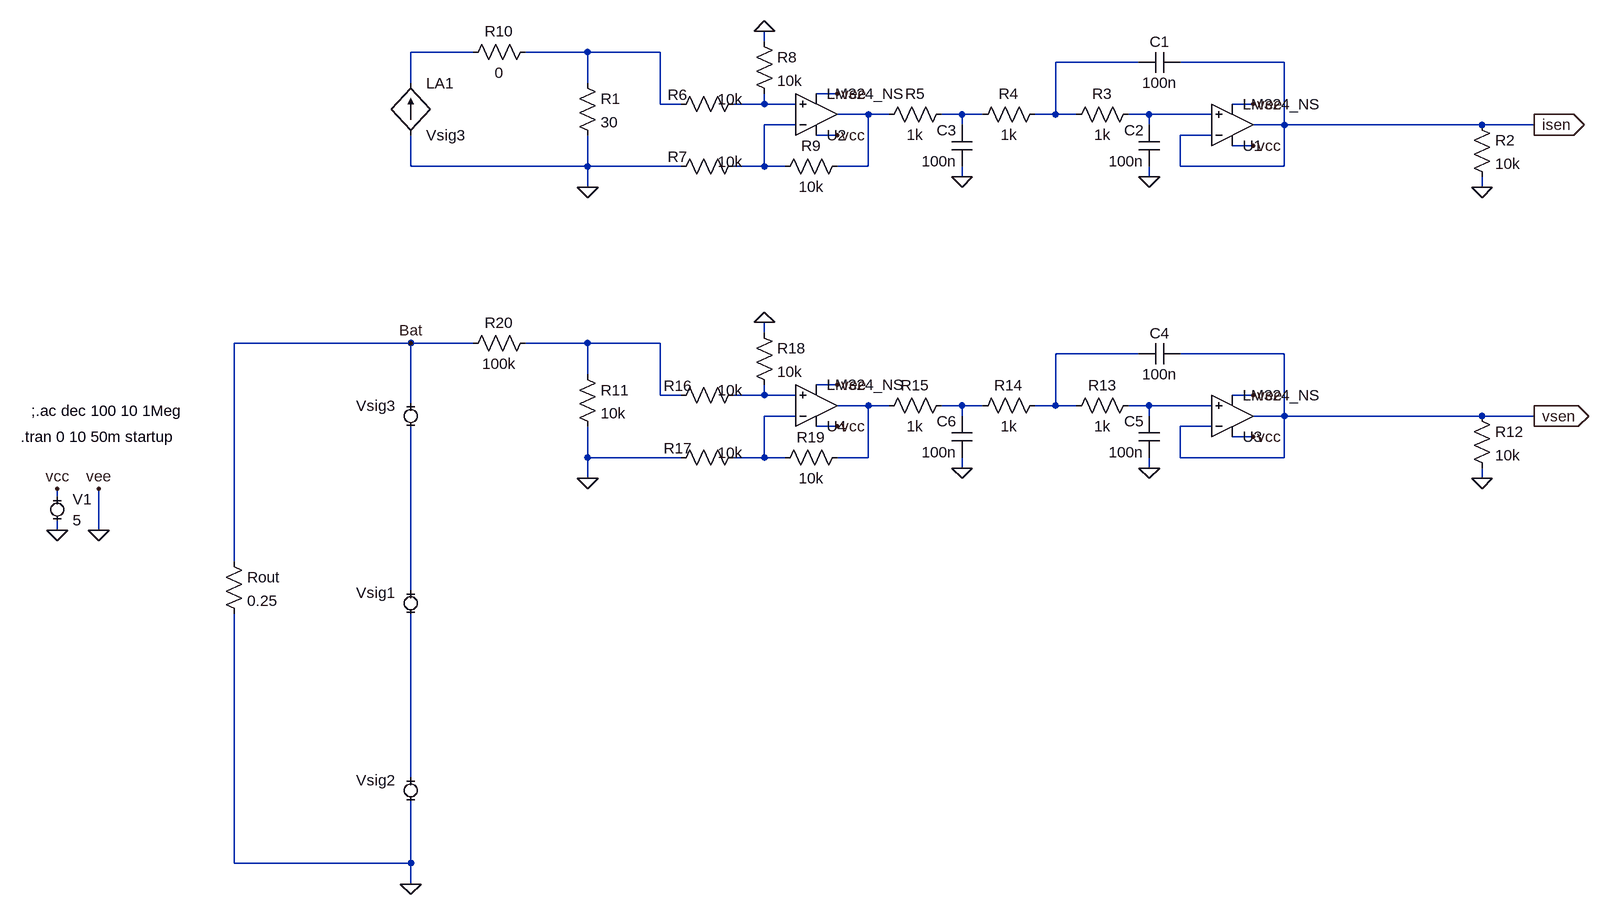
[diagram p0: schematic sensors.asc]
sensors.asc, the LTspice schematic file:
Version 4
SHEET 1 1304 1268
WIRE 16 -80 16 -96
WIRE -432 -64 -528 -64
WIRE -256 -64 -352 -64
WIRE -144 -64 -256 -64
WIRE 592 -48 464 -48
WIRE 816 -48 656 -48
WIRE -528 -16 -528 -64
WIRE -256 -16 -256 -64
WIRE 128 0 96 0
WIRE -144 16 -144 -64
WIRE -112 16 -144 16
WIRE 16 16 16 0
WIRE 16 16 -32 16
WIRE 64 16 16 16
WIRE 768 16 736 16
WIRE 176 32 128 32
WIRE 208 32 176 32
WIRE 320 32 288 32
WIRE 352 32 320 32
WIRE 464 32 464 -48
WIRE 464 32 432 32
WIRE 496 32 464 32
WIRE 608 32 576 32
WIRE 704 32 608 32
WIRE 64 48 16 48
WIRE 320 48 320 32
WIRE 608 48 608 32
WIRE 816 48 816 -48
WIRE 816 48 768 48
WIRE 1120 48 816 48
WIRE 1200 48 1120 48
WIRE 128 64 96 64
WIRE 704 64 656 64
WIRE 768 80 736 80
WIRE -528 112 -528 64
WIRE -256 112 -256 64
WIRE -256 112 -528 112
WIRE -112 112 -256 112
WIRE 16 112 16 48
WIRE 16 112 -32 112
WIRE 48 112 16 112
WIRE 176 112 176 32
WIRE 176 112 128 112
WIRE 656 112 656 64
WIRE 816 112 816 48
WIRE 816 112 656 112
WIRE 320 128 320 112
WIRE 608 128 608 112
WIRE -256 144 -256 112
WIRE 1120 144 1120 128
WIRE 16 368 16 352
WIRE -528 384 -800 384
WIRE -432 384 -528 384
WIRE -256 384 -352 384
WIRE -144 384 -256 384
WIRE 592 400 464 400
WIRE 816 400 656 400
WIRE -256 432 -256 384
WIRE 128 448 96 448
WIRE -144 464 -144 384
WIRE -112 464 -144 464
WIRE 16 464 16 448
WIRE 16 464 -32 464
WIRE 64 464 16 464
WIRE 768 464 736 464
WIRE -528 480 -528 384
WIRE 176 480 128 480
WIRE 208 480 176 480
WIRE 320 480 288 480
WIRE 352 480 320 480
WIRE 464 480 464 400
WIRE 464 480 432 480
WIRE 496 480 464 480
WIRE 608 480 576 480
WIRE 704 480 608 480
WIRE 64 496 16 496
WIRE 320 496 320 480
WIRE 608 496 608 480
WIRE 816 496 816 400
WIRE 816 496 768 496
WIRE 1120 496 816 496
WIRE 1200 496 1120 496
WIRE 128 512 96 512
WIRE 704 512 656 512
WIRE 768 528 736 528
WIRE -256 560 -256 512
WIRE -112 560 -256 560
WIRE 16 560 16 496
WIRE 16 560 -32 560
WIRE 48 560 16 560
WIRE 176 560 176 480
WIRE 176 560 128 560
WIRE 656 560 656 512
WIRE 816 560 816 496
WIRE 816 560 656 560
WIRE 320 576 320 560
WIRE 608 576 608 560
WIRE -256 592 -256 560
WIRE 1120 592 1120 576
WIRE -1072 624 -1072 608
WIRE -1072 672 -1072 656
WIRE -1008 672 -1008 608
WIRE -800 720 -800 384
WIRE -528 768 -528 512
WIRE -528 1056 -528 800
WIRE -800 1184 -800 800
WIRE -528 1184 -528 1088
WIRE -528 1184 -800 1184
WIRE -528 1216 -528 1184
FLAG -256 144 0
FLAG 1200 48 isen
IOPIN 1200 48 Out
FLAG 1120 144 0
FLAG 768 80 vcc
FLAG 768 16 vee
FLAG 608 128 0
FLAG 320 128 0
FLAG 128 64 vcc
FLAG 128 0 vee
FLAG 16 -96 0
FLAG -1072 672 0
FLAG -1072 608 vcc
FLAG -1008 672 0
FLAG -1008 608 vee
FLAG -528 1216 0
FLAG -528 384 Bat
FLAG -256 592 0
FLAG 1200 496 vsen
IOPIN 1200 496 Out
FLAG 1120 592 0
FLAG 768 528 vcc
FLAG 768 464 vee
FLAG 608 576 0
FLAG 320 576 0
FLAG 128 512 vcc
FLAG 128 448 vee
FLAG 16 352 0
SYMBOL f -528 64 M180
WINDOW 0 24 80 Left 2
WINDOW 3 24 0 Left 2
SYMATTR InstName LA1
SYMATTR Value Vsig3
SYMATTR Value2 -0.0005
SYMBOL res -272 -32 R0
SYMATTR InstName R1
SYMATTR Value 30
SYMBOL res 1104 32 R0
SYMATTR InstName R2
SYMATTR Value 10k
SYMBOL EXTRA\\ExtraOpamps\\LM324_NS 736 48 M180
SYMATTR InstName U1
SYMBOL cap 656 -64 R90
WINDOW 0 0 32 VBottom 2
WINDOW 3 32 32 VTop 2
SYMATTR InstName C1
SYMATTR Value 100n
SYMBOL cap 624 48 M0
SYMATTR InstName C2
SYMATTR Value 100n
SYMBOL res 592 16 R90
WINDOW 0 0 56 VBottom 2
WINDOW 3 32 56 VTop 2
SYMATTR InstName R3
SYMATTR Value 1k
SYMBOL res 448 16 R90
WINDOW 0 0 56 VBottom 2
WINDOW 3 32 56 VTop 2
SYMATTR InstName R4
SYMATTR Value 1k
SYMBOL cap 336 48 M0
SYMATTR InstName C3
SYMATTR Value 100n
SYMBOL res 304 16 R90
WINDOW 0 0 56 VBottom 2
WINDOW 3 32 56 VTop 2
SYMATTR InstName R5
SYMATTR Value 1k
SYMBOL res -16 0 R90
WINDOW 0 17 101 VBottom 2
WINDOW 3 -7 20 VTop 2
SYMATTR InstName R6
SYMATTR Value 10k
SYMBOL res -16 96 R90
WINDOW 0 17 101 VBottom 2
WINDOW 3 -7 20 VTop 2
SYMATTR InstName R7
SYMATTR Value 10k
SYMBOL res 0 -96 R0
SYMATTR InstName R8
SYMATTR Value 10k
SYMBOL res 144 96 R90
WINDOW 0 0 56 VBottom 2
WINDOW 3 32 56 VTop 2
SYMATTR InstName R9
SYMATTR Value 10k
SYMBOL EXTRA\\ExtraOpamps\\LM324_NS 96 32 M180
SYMATTR InstName U2
SYMBOL MiniSyms4\\voltage- -1072 640 R0
WINDOW 123 0 0 Left 0
WINDOW 39 0 0 Left 0
SYMATTR InstName V1
SYMATTR Value 5
SYMBOL MiniSyms4\\voltage- -528 784 M0
WINDOW 3 11 11 Invisible 0
WINDOW 39 0 0 Left 0
SYMATTR Value SINE(8.58 8.58 12)
SYMATTR Value2 AC 1.
SYMATTR InstName Vsig1
SYMBOL MiniSyms4\\voltage- -528 1072 M0
WINDOW 3 11 11 Invisible 0
WINDOW 39 0 0 Left 0
SYMATTR Value SINE(8.58 8.58 13)
SYMATTR Value2 AC 1.
SYMATTR InstName Vsig2
SYMBOL res -816 704 R0
SYMATTR InstName Rout
SYMATTR Value 0.25
SYMBOL MiniSyms4\\voltage- -528 496 M0
WINDOW 39 0 0 Left 2
WINDOW 3 11 11 Invisible 0
SYMATTR Value SINE(8.58 8.58 11)
SYMATTR Value2 AC 1.
SYMATTR InstName Vsig3
SYMBOL res -336 -80 R90
WINDOW 0 0 56 VBottom 2
WINDOW 3 32 56 VTop 2
SYMATTR InstName R10
SYMATTR Value 0
SYMBOL res -272 416 R0
SYMATTR InstName R11
SYMATTR Value 10k
SYMBOL res 1104 480 R0
SYMATTR InstName R12
SYMATTR Value 10k
SYMBOL EXTRA\\ExtraOpamps\\LM324_NS 736 496 M180
SYMATTR InstName U3
SYMBOL cap 656 384 R90
WINDOW 0 0 32 VBottom 2
WINDOW 3 32 32 VTop 2
SYMATTR InstName C4
SYMATTR Value 100n
SYMBOL cap 624 496 M0
SYMATTR InstName C5
SYMATTR Value 100n
SYMBOL res 592 464 R90
WINDOW 0 0 56 VBottom 2
WINDOW 3 32 56 VTop 2
SYMATTR InstName R13
SYMATTR Value 1k
SYMBOL res 448 464 R90
WINDOW 0 0 56 VBottom 2
WINDOW 3 32 56 VTop 2
SYMATTR InstName R14
SYMATTR Value 1k
SYMBOL cap 336 496 M0
SYMATTR InstName C6
SYMATTR Value 100n
SYMBOL res 304 464 R90
WINDOW 0 0 56 VBottom 2
WINDOW 3 32 56 VTop 2
SYMATTR InstName R15
SYMATTR Value 1k
SYMBOL res -16 448 R90
WINDOW 0 17 101 VBottom 2
WINDOW 3 -7 20 VTop 2
SYMATTR InstName R16
SYMATTR Value 10k
SYMBOL res -16 544 R90
WINDOW 0 17 101 VBottom 2
WINDOW 3 -7 20 VTop 2
SYMATTR InstName R17
SYMATTR Value 10k
SYMBOL res 0 352 R0
SYMATTR InstName R18
SYMATTR Value 10k
SYMBOL res 144 544 R90
WINDOW 0 0 56 VBottom 2
WINDOW 3 32 56 VTop 2
SYMATTR InstName R19
SYMATTR Value 10k
SYMBOL EXTRA\\ExtraOpamps\\LM324_NS 96 480 M180
SYMATTR InstName U4
SYMBOL res -336 368 R90
WINDOW 0 0 56 VBottom 2
WINDOW 3 32 56 VTop 2
SYMATTR InstName R20
SYMATTR Value 100k
TEXT -1128 528 Left 2 !.tran 0 10 50m startup
TEXT -1112 488 Left 2 !;.ac dec 100 10 1Meg

The netlist it stands for:
* sensors.asc
F§LA1 0 N001 Vsig3 -0.0005
R1 N002 0 30
R2 isen 0 10k
* U1: LM324_NS (symbol EXTRA\ExtraOpamps\LM324_NS not available, pins judged from their places): In+=N007 In-=isen V+=vcc V-=0 OUT=isen
C1 isen N003 100n
C2 N007 0 100n
R3 N007 N003 1k
R4 N003 N006 1k
C3 N006 0 100n
R5 N006 N005 1k
R6 N004 N002 10k
R7 N008 0 10k
R8 0 N004 10k
R9 N005 N008 10k
* U2: LM324_NS (symbol EXTRA\ExtraOpamps\LM324_NS not available, pins judged from their places): In+=N004 In-=N008 V+=vcc V-=0 OUT=N005
V1 vcc 0 5
Vsig1 N016 N017 SINE(8.58 8.58 12) AC 1.
Vsig2 N017 0 SINE(8.58 8.58 13) AC 1.
Rout Bat 0 0.25
Vsig3 Bat N016 SINE(8.58 8.58 11) AC 1.
R10 N002 N001 0
R11 N009 0 10k
R12 vsen 0 10k
* U3: LM324_NS (symbol EXTRA\ExtraOpamps\LM324_NS not available, pins judged from their places): In+=N014 In-=vsen V+=vcc V-=0 OUT=vsen
C4 vsen N010 100n
C5 N014 0 100n
R13 N014 N010 1k
R14 N010 N013 1k
C6 N013 0 100n
R15 N013 N012 1k
R16 N011 N009 10k
R17 N015 0 10k
R18 0 N011 10k
R19 N012 N015 10k
* U4: LM324_NS (symbol EXTRA\ExtraOpamps\LM324_NS not available, pins judged from their places): In+=N011 In-=N015 V+=vcc V-=0 OUT=N012
R20 N009 Bat 100k
.tran 0 10 50m startup
;.ac dec 100 10 1Meg
.backanno
.end